# EasyEDA schematic Door.json
TITLE: Door Project; REV: 1.0; Date: 2019-05-10; Sheet: 1/1; Drawn By: abdullahomran9; Company: Abdullah Omran
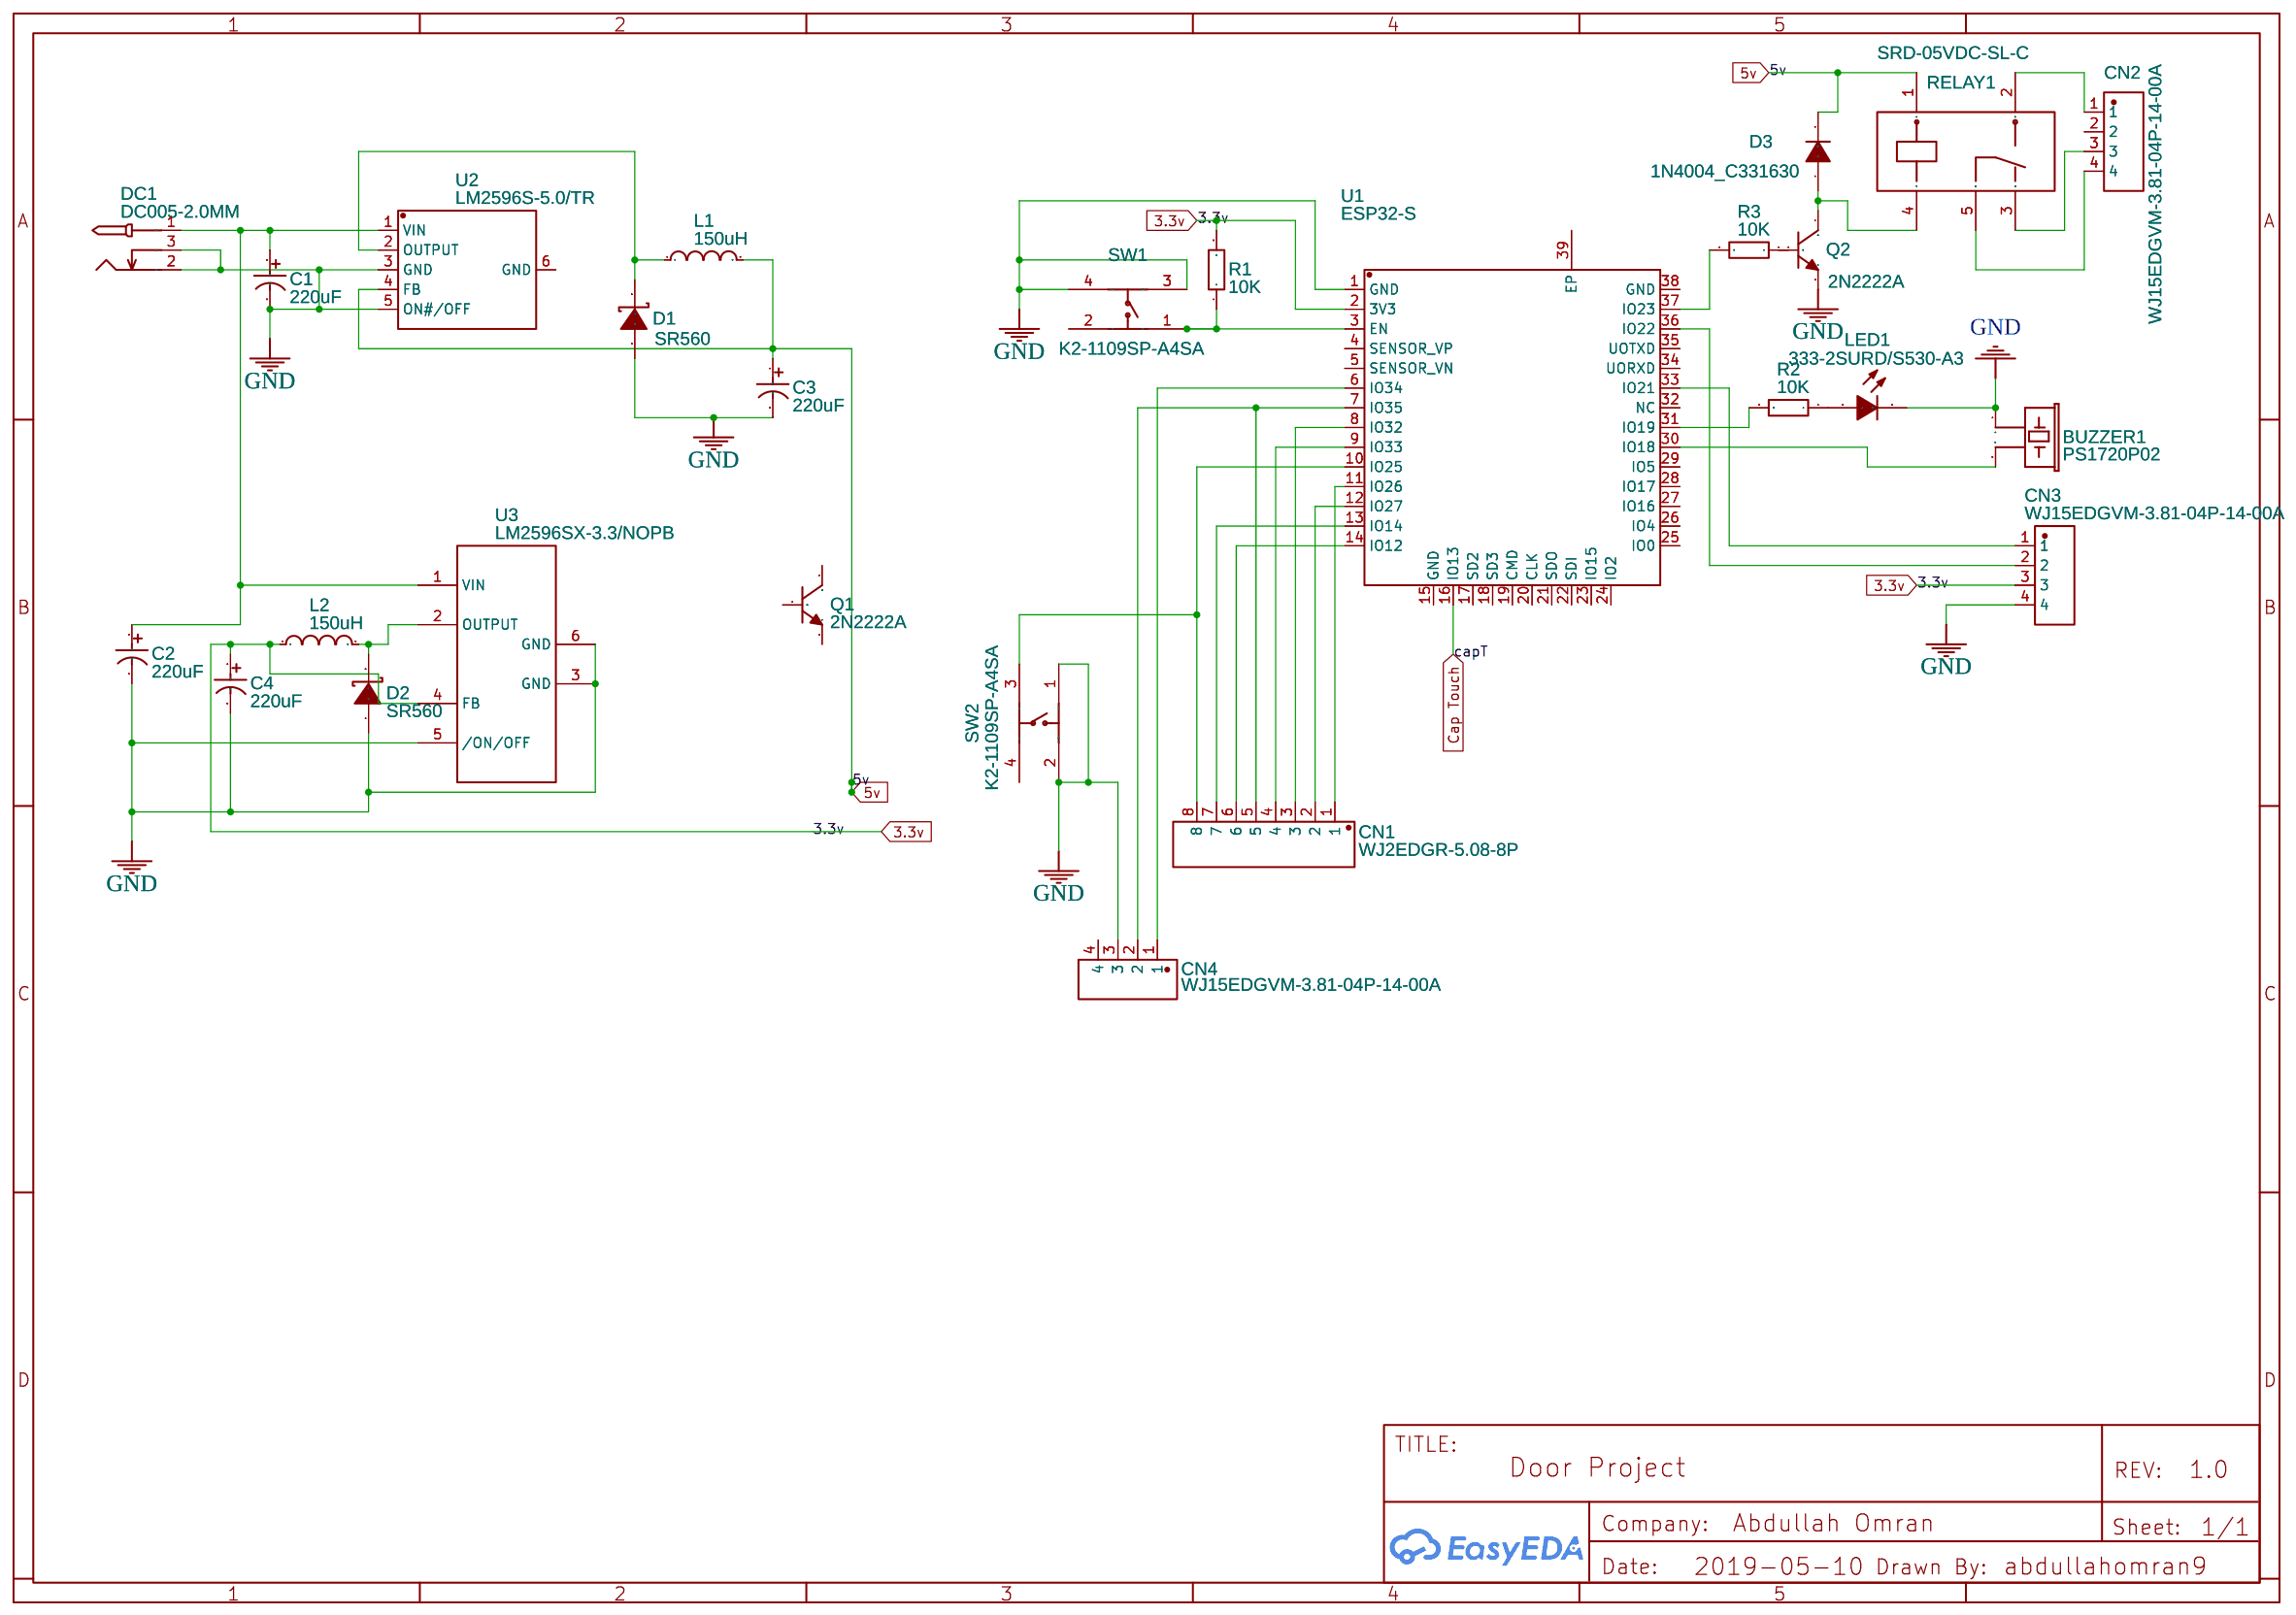
[diagram p0: schematic sheet]

## Parts
BUZZER1  PS1720P02  [PS1720P02]
C1  220uF  [CAP-D6.3XF2.5]
C2  220uF  [CAP-D6.3XF2.5]
C3  220uF  [CAP-D6.3XF2.5]
C4  220uF  [CAP-D6.3XF2.5]
CN1  WJ2EDGR-5.08-8P  [WJ2EDGR-5.08-8P]
CN2  WJ15EDGVM-3.81-04P-14-00A  [WJ15EDGVM-3.81-04P-14-00A]
CN3  WJ15EDGVM-3.81-04P-14-00A  [WJ15EDGVM-3.81-04P-14-00A]
CN4  WJ15EDGVM-3.81-04P-14-00A  [WJ15EDGVM-3.81-04P-14-00A]
D1  SR560  [DO-201AD]
D2  SR560  [DO-201AD]
D3  1N4004_C331630  [DO-15]
DC1  DC005-2.0MM  [DC-5020]
L1  150uH  [VLU0608]
L2  150uH  [VLU0608]
LED1  333-2SURD/S530-A3  [LED-5MM-2.54MM]
Q1  2N2222A  [TO-92(TO-92-3F)-2.54]
Q2  2N2222A  [TO-92(TO-92-3F)-2.54]
R1  10K  [AXIAL-0.5]
R2  10K  [AXIAL-0.5]
R3  10K  [AXIAL-0.5]
RELAY1  SRD-05VDC-SL-C  [RELAY-SL-SRD]
SW1  K2-1109SP-A4SA  [KEY-4.5*4.5]
SW2  K2-1109SP-A4SA  [KEY-4.5*4.5]
U1  ESP32-S  [ESP32-S]
U2  LM2596S-5.0/TR  [TO-263-5]
U3  LM2596SX-3.3/NOPB  [TO-263-5]

## Library data of the parts
BUZZER1 = -: Supplier: LCSC; Manufacturer: TDK; Supplier Part: C96061
C1-C4 = 220uF 25V: Supplier: LCSC; Manufacturer: ValuePro; Supplier Part: C12450
CN1 = -: Supplier: LCSC; Manufacturer: ReliaPro; image: //image.lceda.cn/szlcsc/C31423.jpg; Supplier Part: C31423
CN2-CN4 = -: Supplier: LCSC; Manufacturer: ReliaPro; Contributor: LCSC; Supplier Part: C157478
D1 D2 = -: Supplier: LCSC; Manufacturer: MDD; image: //image.lceda.cn/szlcsc/C38272.jpg; Supplier Part: C38272
D3 = -: Supplier: LCSC; Supplier Part: C331630; Manufacturer: GW; Manufacturer Part: 1N4004; Contributor: LCSC
DC1 = -: Supplier: LCSC; Manufacturer: SOFNG; Supplier Part: C111567
L1 L2 = VLU0608-151K: Supplier: LCSC; Manufacturer: FH; Supplier Part: C128032
LED1 = -: Supplier: LCSC; Manufacturer: EVERLIGHT; Supplier Part: C87271
Q1 Q2 = -: Supplier: LCSC; Supplier Part: C358533; Manufacturer: Foshan Blue Rocket Elec; Contributor: LCSC
R1-R3 = RD50T5103J: Supplier: LCSC; Supplier Part: C167530; Manufacturer: TA-I Tech; Contributor: LCSC
RELAY1 = -: Supplier: LCSC; Manufacturer: SONGLE; image: //image.lceda.cn/szlcsc/C35449.jpg; Supplier Part: C35449
SW1 SW2 = -: Supplier: LCSC; Manufacturer: HRO; Supplier Part: C92581
U1 = -: Supplier: LCSC; Supplier Part: C277944; Manufacturer: Ai-Thinker; Contributor: LCSC
U2 = -: Supplier: LCSC; Supplier Part: C194349; Manufacturer: HGSEMI; Contributor: LCSC; LCSC Assembly: Yes; SMT Type: Extend
U3 = -: Supplier: LCSC; Manufacturer: TI; image: //image.lceda.cn/szlcsc/C7929.jpg; Supplier Part: C7929; LCSC Assembly: Yes; SMT Type: Extend

## Nets
3.3v: C4.1 CN3.3 L2.1 R1.2 U1.2(3V3) U3.4(FB)
5v: C3.1 D3.2 L1.2 RELAY1.1 U2.4(FB)
GND: BUZZER1.1 C1.2 C2.2 C3.2 C4.2 CN3.4 CN4.3 D1.1(A) D2.1(A) DC1.2 DC1.3 LED1.2(C) Q2.3(E) SW1.3 SW1.4 SW2.1 SW2.2 U1.1(GND) U2.3(GND) U2.5(ON#/OFF) U3.3(GND) U3.5(/ON/OFF) U3.6(GND)
Cap Touch: U1.16(IO13)
Net-(BUZZER1-2): BUZZER1.2 U1.30(IO18)
Net-(C1-1): C1.1 C2.1 DC1.1 U2.1(VIN) U3.1(VIN)
Net-(CN1-1): CN1.1 U1.11(IO26)
Net-(CN1-2): CN1.2 U1.12(IO27)
Net-(CN1-3): CN1.3 U1.8(IO32)
Net-(CN1-4): CN1.4 U1.9(IO33)
Net-(CN1-5): CN1.5 CN4.2 U1.7(IO35)
Net-(CN1-6): CN1.6 U1.14(IO12)
Net-(CN1-7): CN1.7 U1.13(IO14)
Net-(CN1-8): CN1.8 SW2.3 U1.10(IO25)
Net-(CN2-1): CN2.1 RELAY1.2
Net-(CN2-3): CN2.3 RELAY1.3
Net-(CN2-4): CN2.4 RELAY1.5
Net-(CN3-1): CN3.1 U1.33(IO21)
Net-(CN3-2): CN3.2 U1.36(IO22)
Net-(CN4-1): CN4.1 U1.6(IO34)
Net-(D1-2): D1.2(K) L1.1 U2.2(OUTPUT)
Net-(D2-2): D2.2(K) L2.2 U3.2(OUTPUT)
Net-(D3-1): D3.1 Q2.1(C) RELAY1.4
Net-(LED1-1): LED1.1(A) R2.1
Net-(Q2-2): Q2.2(B) R3.1
Net-(R1-1): R1.1 SW1.1 U1.3(EN)
Net-(R2-2): R2.2 U1.31(IO19)
Net-(R3-2): R3.2 U1.37(IO23)

Not connected (* = marked no-connect by the designer): CN2 2; CN4 4; Q1 1(C) 2(B) 3(E); SW1 2; SW2 4; U1 4(SENSOR_VP) 5(SENSOR_VN) 15(GND) 17(SD2) 18(SD3) 19(CMD) 20(CLK) 21(SDO) 22(SDI) 23(IO15) 24(IO2) 25(IO0) 26(IO4) 27(IO16) 28(IO17) 29(IO5) 32(NC) 34(UORXD) 35(UOTXD) 38(GND) 39(EP); U2 6(GND)
